# EAGLE design Wechselblinker (EAGLE 4.16)
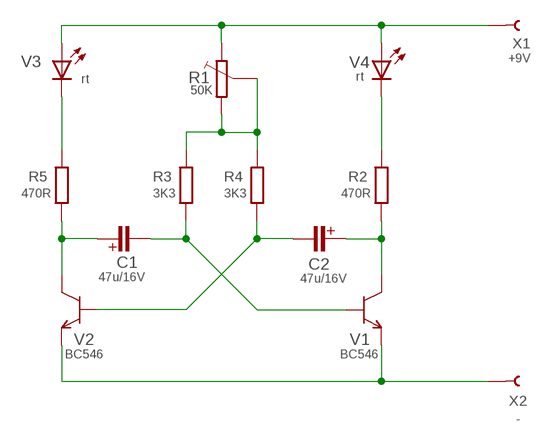
[diagram p0: schematic, sheet 1]

## Parts
C1  47u/16V  CPOL-EUE2.5-6  [E2,5-6]
C2  47u/16V  CPOL-EUE2.5-6  [E2,5-6]
R1  50K  PT10LIEG  [PT-10]
R2  470R  R-EU_0207/10  [0207/10]
R3  3K3  R-EU_0207/10  [0207/10]
R4  3K3  R-EU_0207/10  [0207/10]
R5  470R  R-EU_0207/10  [0207/10]
V1  BC546  NPN_EBCBC546  [TO92IL]
V2  BC546  NPN_EBCBC546  [TO92IL]
V3  rt  LED5MM  [LED5]
V4  rt  LED5MM  [LED5]
X1  +9V  LSP1  [LSP1]
X2  -  LSP1  [LSP1]

## Nets
N$1: R1.E V3.A V4.A X1.1
N$2: C1.+ R5.1 V2.C
N$3: R1.A R1.S R3.2 R4.2
N$4: R5.2 V3.K(C)
N$5: R2.2 V4.K(C)
N$6: C2.+ R2.1 V1.C
N$7: C1.- R3.1 V1.B
N$8: C2.- R4.1 V2.B
N$9: V1.E V2.E X2.1

## Library data of the parts
C1 C2 = mylib:CPOL-EU: POLARIZED CAPACITOR, European symbol
R1 = mylib:PT10
R2-R5 = mylib:R-EU_: RESISTOR, European symbol
V1 V2 = mylib:NPN_EBC
V3 V4 = mylib:LED
X1 X2 = mylib:LSP1

## Board
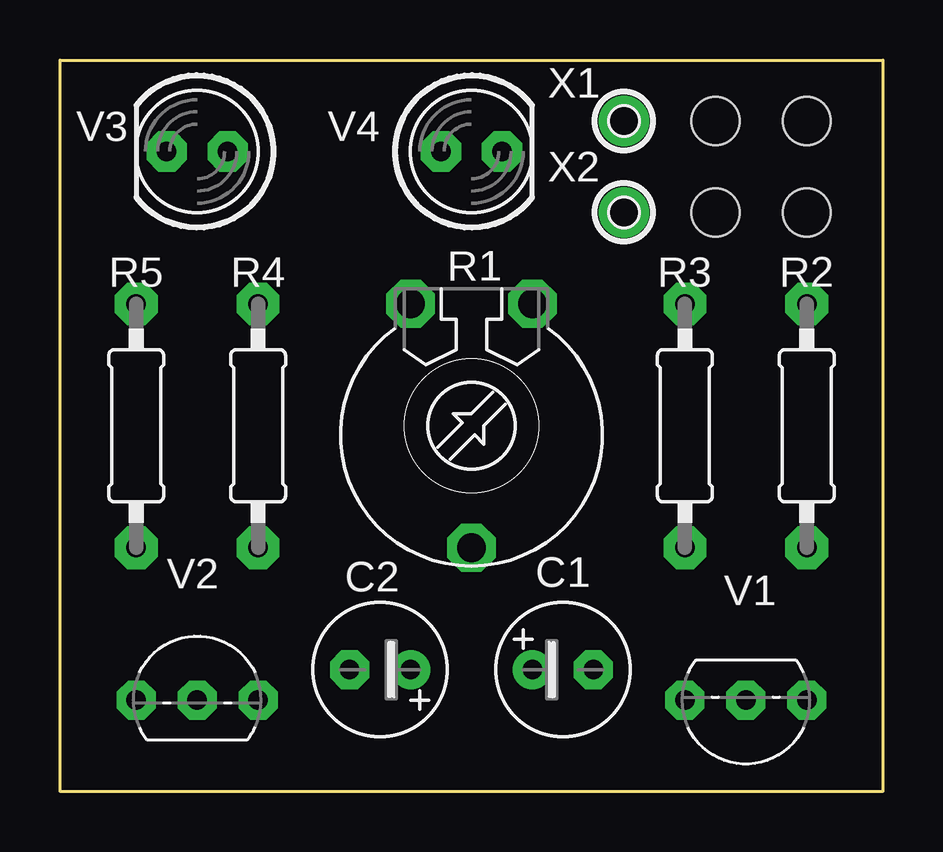
[diagram p1: board, top side]
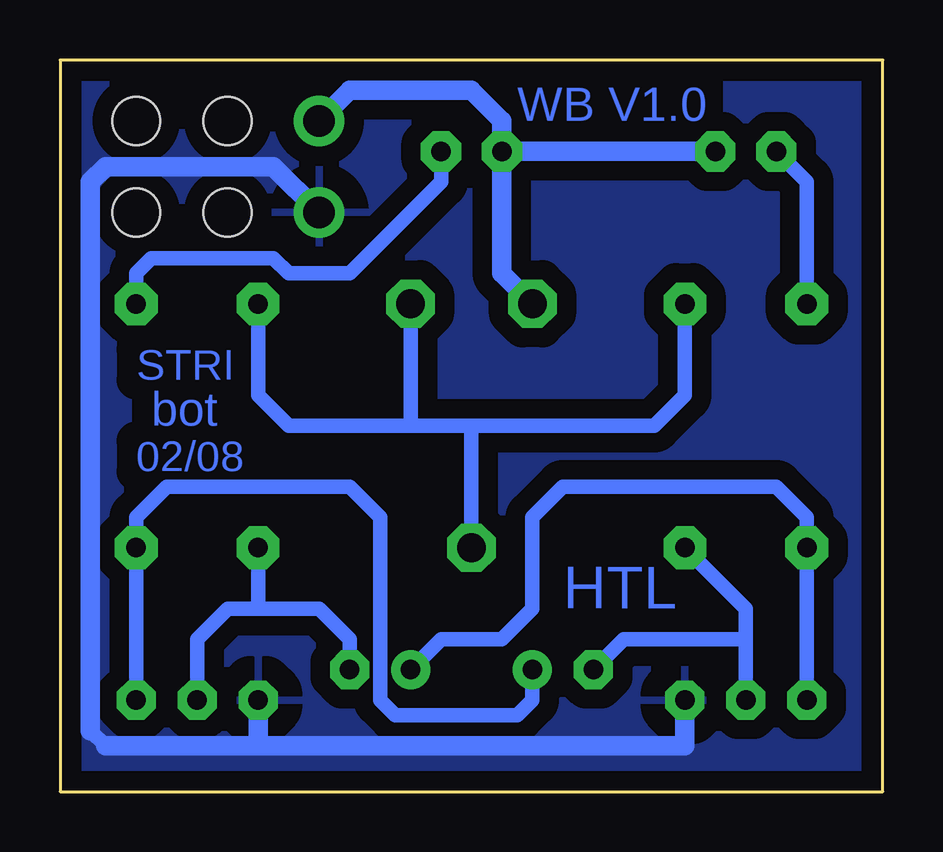
[diagram p2: board, bottom side, seen from below]

Size 34.29 x 30.48 mm. Coordinates in mm from the lower left corner, seen from the top.
Outline: 0,0 0,30.48 34.29,30.48 34.29,0 0,0
Copper layers (1+16): Top 0.035mm / dielectric 1.5mm / Bottom 0.035mm
Design rules "2HN": minimum track width 16mil, minimum drill 0.6mm, track to track 10mil, track to pad 8mil, pad to pad 8mil, via to via 8mil, smd to smd 8mil, copper to edge 20mil, drill to drill 8mil, minimum pad ring 16mil, minimum via ring 15mil, stop-mask expansion 4mil, vias tented up to drill 0mil, thermal gap 40mil
Holes 2 mm at 27.3,27.94 27.3,24.13 31.11,24.13 31.11,27.94

### Footprints (pad centres in the part's own frame; a part is rotated, then mirrored left to right if it is on the bottom)
E2,5-6 = drill 0.813 pad 1.6 round: + -1.27,0 | drill 0.813 pad 1.6 octagon: - 1.27,0
PT-10 = drill 1.2 octagon: A -2.54,-5.08; E 2.54,-5.08; S 0,5.08
0207/10 = drill 0.813 pad 1.778 octagon: 1 -5.08,0; 2 5.08,0
TO92IL = drill 0.813 octagon: B 0,0; C -2.54,0; E 2.54,0
LED5 = drill 0.813 pad 1.676 octagon: A -1.27,0; K 1.27,0
LSP1 = drill 1.3 round: 1 0,0

### Placement (x,y rotation side)
C1  20.95,5.08 0 top
C2  13.34,5.08 180 top
R1  17.14,15.24 180 top
R2  31.11,15.24 90 top
R3  26.04,15.24 90 top
R4  8.26,15.24 90 top
R5  3.17,15.24 90 top
V1  28.57,3.81 180 top
V2  5.71,3.81 0 top
V3  5.71,26.67 180 top
V4  17.14,26.67 0 top
X1  23.5,27.94 0 top
X2  23.5,24.13 0 top

### Tracks (layer width: path | path; a pad name or v marks a point on that pad's centre or on a via)
N$1
  Bottom 0.813: V4.A 15.88,21.59 R1.E | V3.A V4.A | V4.A 15.88,27.94 17.14,29.21 22.23,29.21 X1.1
N$2
  Bottom 0.61: V2.C R5.1 3.17,11.43 4.45,12.7 13.34,12.7 14.61,11.43 14.61,7.62 15.88,6.35 18.41,6.35 C1.+
N$3
  Bottom 0.61: R4.2 8.26,16.51 9.53,15.24 17.14,15.24 | 17.14,15.24 19.68,15.24 | 19.68,15.24 24.77,15.24 26.04,16.51 R3.2 | 19.68,15.24 R1.A | 17.14,15.24 R1.S
N$4
  Bottom 0.61: V3.K 3.17,25.4 R5.2
N$5
  Bottom 0.61: V4.K 18.41,25.4 22.23,21.59 24.77,21.59 25.4,22.23 30.48,22.23 31.11,21.59 R2.2
N$6
  Bottom 0.61: V1.C R2.1 31.11,11.43 29.84,12.7 22.23,12.7 20.95,11.43 20.95,3.81 20.32,3.17 15.24,3.17 14.61,3.81 C2.+
N$7
  Bottom 0.61: 26.04,7.62 R3.1 | 26.04,7.62 27.3,7.62 28.57,6.35 V1.B | C1.- 22.23,6.35 23.5,7.62 26.04,7.62
N$8
  Bottom 0.61: V2.B 5.71,6.35 | 5.71,6.35 5.71,7.62 R4.1 | C2.- 10.79,6.35 5.71,6.35
N$9
  Bottom 0.61: 32.38,1.91 33.02,2.54
  Bottom 0.813: X2.1 25.4,26.04 32.38,26.04 33.02,25.4 33.02,2.54 | 26.04,1.91 32.38,1.91 | 26.04,1.91 V1.E | 26.04,1.91 8.26,1.91 V2.E
  pour Bottom (isolate 0.813): 0,30.48 0,0 34.29,0 34.29,30.48

### Text on the board
Bottom: WB V1.0 | STRI | bot | 02/08 | HTL